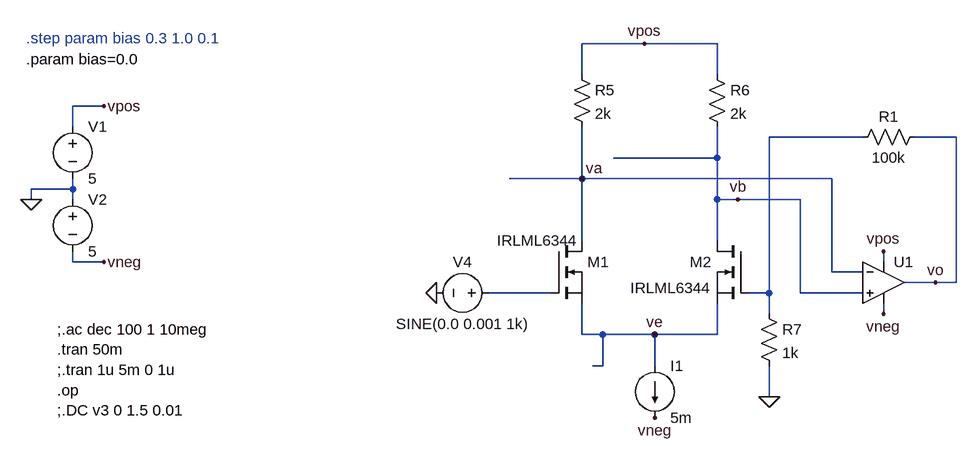
[diagram p0: schematic esf_type2.asc]
esf_type2.asc, the LTspice schematic file:
Version 4
SHEET 1 1172 728
WIRE 688 -32 592 -32
WIRE 800 -32 688 -32
WIRE 592 16 592 -32
WIRE 800 16 800 -32
WIRE -144 64 -192 64
WIRE -192 96 -192 64
WIRE 1024 112 880 112
WIRE 1168 112 1104 112
WIRE 800 144 800 96
WIRE 800 144 640 144
WIRE 592 176 592 96
WIRE 592 176 480 176
WIRE 976 176 592 176
WIRE -192 192 -192 176
WIRE -192 192 -256 192
WIRE -256 208 -256 192
WIRE -192 208 -192 192
WIRE 800 208 800 144
WIRE 832 208 800 208
WIRE 928 208 832 208
WIRE 592 272 592 176
WIRE 800 272 800 208
WIRE -192 304 -192 288
WIRE -144 304 -192 304
WIRE 1056 304 1056 288
WIRE 976 320 976 176
WIRE 1024 320 976 320
WIRE 1136 336 1088 336
WIRE 1168 336 1168 112
WIRE 1168 336 1136 336
WIRE 544 352 448 352
WIRE 880 352 880 112
WIRE 880 352 848 352
WIRE 928 352 928 208
WIRE 1024 352 928 352
WIRE 880 384 880 352
WIRE 1056 384 1056 368
WIRE 592 416 592 368
WIRE 624 416 592 416
WIRE 704 416 624 416
WIRE 800 416 800 368
WIRE 800 416 704 416
WIRE 624 464 624 416
WIRE 624 464 608 464
WIRE 704 464 704 416
WIRE 880 512 880 464
FLAG -256 208 0
FLAG -144 64 vpos
FLAG -144 304 vneg
FLAG 1056 288 vpos
FLAG 1056 384 vneg
FLAG 368 352 0
FLAG 1136 336 vo
FLAG 704 544 vneg
FLAG 688 -32 vpos
FLAG 880 512 0
FLAG 592 176 va
FLAG 832 208 vb
FLAG 704 416 ve
DATAFLAG 480 176 "$"
DATAFLAG 688 144 "$"
DATAFLAG 608 464 "$"
SYMBOL voltage -192 80 R0
SYMATTR InstName V1
SYMATTR Value 5
SYMBOL voltage -192 192 R0
SYMATTR InstName V2
SYMATTR Value 5
SYMBOL OpAmps/UniversalOpAmp2 1056 336 R0
SYMATTR InstName U1
SYMBOL Res 1120 96 R90
WINDOW 0 0 56 VBottom 2
WINDOW 3 32 56 VTop 2
SYMATTR InstName R1
SYMATTR Value 100k
SYMBOL voltage 464 352 R90
WINDOW 0 -32 56 VBottom 2
WINDOW 3 32 56 VTop 2
SYMATTR InstName V4
SYMATTR Value SINE(0.0 0.001 1k)
SYMATTR SpiceLine Rser=1meg
SYMATTR Value2 AC 1
SYMBOL nmos 544 272 R0
WINDOW 3 -83 -1 Left 2
SYMATTR InstName M1
SYMATTR Value IRLML6344
SYMBOL nmos 848 272 M0
SYMATTR InstName M2
SYMATTR Value IRLML6344
SYMBOL current 704 464 R0
SYMATTR InstName I1
SYMATTR Value 5m
SYMBOL Res 576 0 R0
SYMATTR InstName R5
SYMATTR Value 2k
SYMBOL Res 784 0 R0
SYMATTR InstName R6
SYMATTR Value 2k
SYMBOL Res 864 368 R0
SYMATTR InstName R7
SYMATTR Value 1k
TEXT -216 408 Left 2 !;.ac dec 100 1 10meg\n.tran 50m\n;.tran 1u 5m 0 1u\n.op\n;.DC v3 0 1.5 0.01
TEXT -264 -40 Left 2 ;.step param bias 0.3 1.0 0.1
TEXT -264 -8 Left 2 !.param bias=0.0

The netlist it stands for:
* esf_type2.asc
V1 vpos 0 5
V2 0 vneg 5
XU1 vb va vpos vneg vo level2 Avol=1Meg GBW=10Meg Slew=10Meg Ilimit=25m Rail=0 Vos=0 En=0 Enk=0 In=0 Ink=0 Rin=500Meg  ; pins In+ In- V+ V- OUT
R1 vo N001 100k
V4 N002 0 SINE(0.0 0.001 1k) AC 1 Rser=1meg
M1 va N002 ve ve IRLML6344
M2 vb N001 ve ve IRLML6344
I1 ve vneg 5m
R5 vpos va 2k
R6 vpos vb 2k
R7 N001 0 1k
.model NMOS NMOS
.model PMOS PMOS
.lib standard.mos
;.ac dec 100 1 10meg
.tran 50m
;.tran 1u 5m 0 1u
.op
;.DC v3 0 1.5 0.01
* .step param bias 0.3 1.0 0.1
.param bias=0.0
.lib UniversalOpAmp2.lib
.backanno
.end